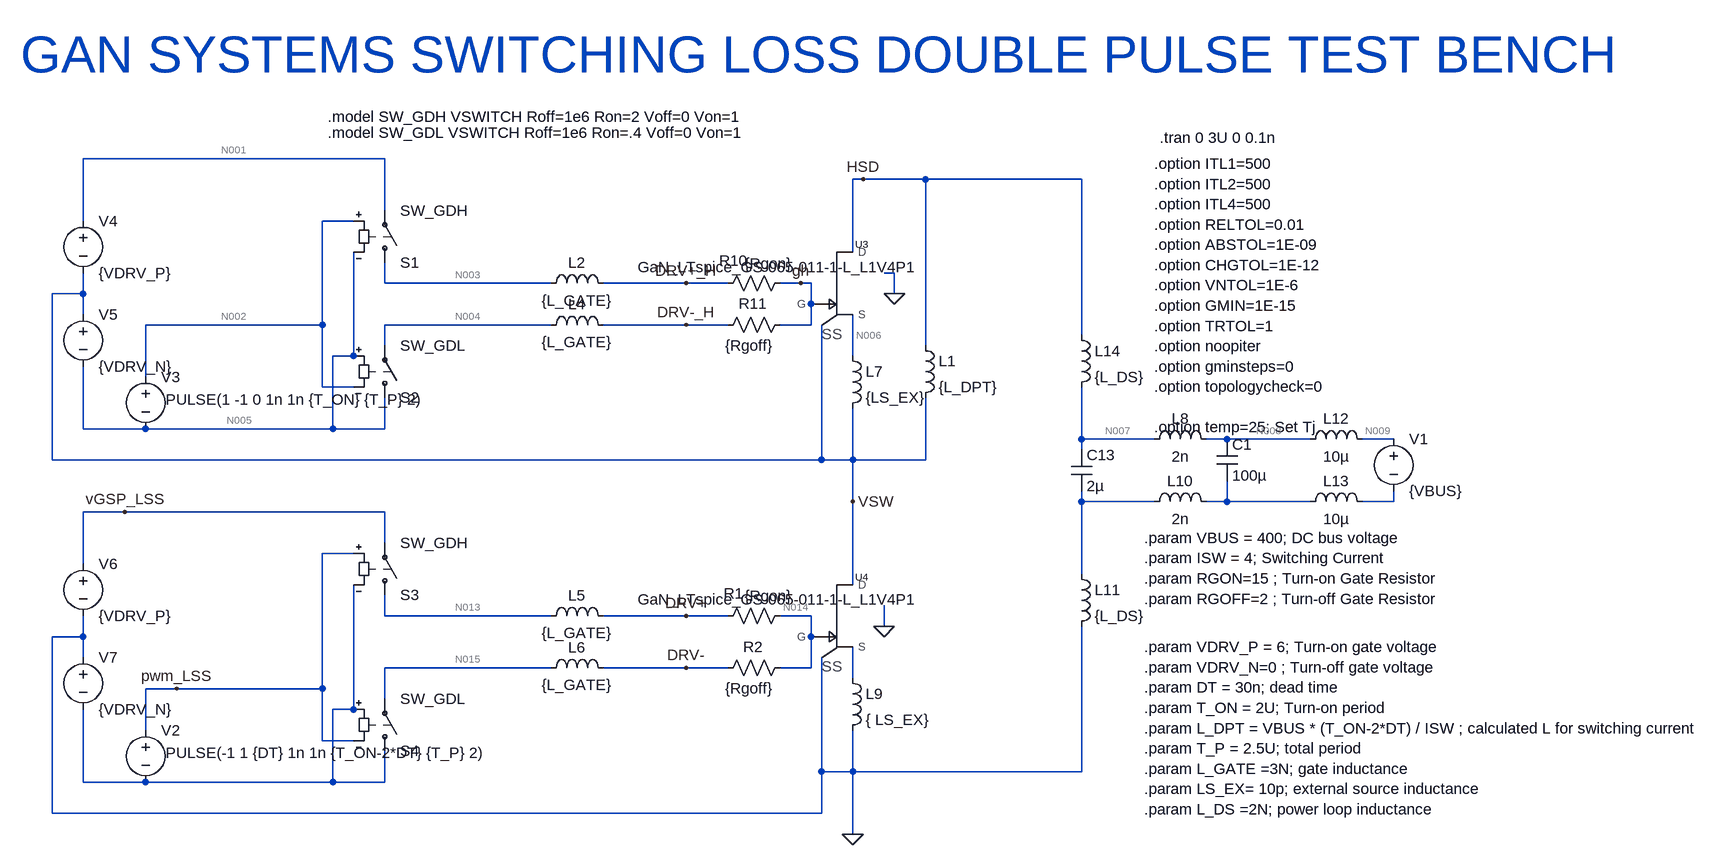
[diagram p0: schematic GN008_GANSYS_Half_Bridge_Switching_Test_v2.asc]
GN008_GANSYS_Half_Bridge_Switching_Test_v2.asc, the LTspice schematic file:
Version 4
SHEET 1 3212 1348
WIRE -576 -592 -1040 -592
WIRE 160 -560 144 -560
WIRE 256 -560 160 -560
WIRE 496 -560 256 -560
WIRE -576 -512 -576 -592
WIRE -1040 -496 -1040 -592
WIRE -624 -496 -672 -496
WIRE 144 -448 144 -560
WIRE 208 -416 192 -416
WIRE -576 -400 -576 -432
WIRE -320 -400 -576 -400
WIRE -112 -400 -240 -400
WIRE -48 -400 -112 -400
WIRE 64 -400 32 -400
WIRE 80 -400 64 -400
WIRE -1040 -384 -1040 -416
WIRE -1040 -384 -1088 -384
WIRE 208 -384 208 -416
WIRE 80 -368 80 -400
WIRE -1040 -352 -1040 -384
WIRE -672 -336 -672 -496
WIRE -672 -336 -944 -336
WIRE -320 -336 -576 -336
WIRE -112 -336 -240 -336
WIRE -48 -336 -112 -336
WIRE 80 -336 80 -368
WIRE 80 -336 32 -336
WIRE 496 -320 496 -560
WIRE -576 -304 -576 -336
WIRE 256 -304 256 -560
WIRE -624 -288 -624 -448
WIRE -624 -288 -656 -288
WIRE 144 -288 144 -352
WIRE -944 -256 -944 -336
WIRE -672 -240 -672 -336
WIRE -624 -240 -672 -240
WIRE -1040 -176 -1040 -272
WIRE -944 -176 -1040 -176
WIRE -656 -176 -656 -288
WIRE -656 -176 -944 -176
WIRE -576 -176 -576 -224
WIRE -576 -176 -656 -176
WIRE 496 -160 496 -240
WIRE 608 -160 496 -160
WIRE 720 -160 688 -160
WIRE 848 -160 720 -160
WIRE 976 -160 928 -160
WIRE 496 -144 496 -160
WIRE -1088 -128 -1088 -384
WIRE 96 -128 96 -336
WIRE 96 -128 -1088 -128
WIRE 144 -128 144 -208
WIRE 144 -128 96 -128
WIRE 256 -128 256 -224
WIRE 256 -128 144 -128
WIRE 144 -64 144 -128
WIRE 496 -64 496 -80
WIRE 608 -64 496 -64
WIRE 720 -64 720 -96
WIRE 720 -64 688 -64
WIRE 848 -64 720 -64
WIRE 976 -64 976 -80
WIRE 976 -64 928 -64
WIRE -976 -48 -1040 -48
WIRE -576 -48 -976 -48
WIRE -576 0 -576 -48
WIRE -624 16 -672 16
WIRE -1040 32 -1040 -48
WIRE 496 48 496 -64
WIRE 144 64 144 -64
WIRE -576 112 -576 80
WIRE -320 112 -576 112
WIRE -112 112 -240 112
WIRE -48 112 -112 112
WIRE 80 112 32 112
WIRE 192 128 192 96
WIRE -1040 144 -1040 112
WIRE -1040 144 -1088 144
WIRE 80 144 80 112
WIRE -1040 176 -1040 144
WIRE -320 192 -576 192
WIRE -112 192 -240 192
WIRE -48 192 -112 192
WIRE 80 192 80 144
WIRE 80 192 32 192
WIRE 144 208 144 160
WIRE -896 224 -944 224
WIRE -672 224 -672 16
WIRE -672 224 -896 224
WIRE -576 240 -576 192
WIRE -624 256 -624 64
WIRE -624 256 -656 256
WIRE -944 288 -944 224
WIRE -672 304 -672 224
WIRE -624 304 -672 304
WIRE 96 352 96 176
WIRE 144 352 144 288
WIRE 144 352 96 352
WIRE 496 352 496 128
WIRE 496 352 144 352
WIRE -1040 368 -1040 256
WIRE -944 368 -1040 368
WIRE -656 368 -656 256
WIRE -656 368 -944 368
WIRE -576 368 -576 320
WIRE -576 368 -656 368
WIRE -1088 416 -1088 144
WIRE 96 416 96 352
WIRE 96 416 -1088 416
WIRE 144 448 144 352
FLAG -976 -48 vGSP_LSS
FLAG -896 224 pwm_LSS
FLAG 144 448 0
FLAG -112 112 DRV+
FLAG -112 192 DRV-
FLAG 208 -384 0
FLAG 192 128 0
FLAG -112 -400 DRV+_H
FLAG -112 -336 DRV-_H
FLAG 64 -400 gh
FLAG 160 -560 HSD
FLAG 144 -64 VSW
SYMBOL voltage 976 -176 R0
WINDOW 123 0 0 Left 2
WINDOW 39 0 0 Left 2
SYMATTR InstName V1
SYMATTR Value {VBUS}
SYMBOL cap 480 -144 R0
SYMATTR InstName C13
SYMATTR Value 2µ
SYMBOL ind 832 -144 R270
WINDOW 0 32 56 VTop 2
WINDOW 3 5 56 VBottom 2
SYMATTR InstName L12
SYMATTR Value 10µ
SYMBOL ind 832 -48 R270
WINDOW 0 32 56 VTop 2
WINDOW 3 5 56 VBottom 2
SYMATTR InstName L13
SYMATTR Value 10µ
SYMBOL ind 480 -336 R0
SYMATTR InstName L14
SYMATTR Value {L_DS}
SYMATTR SpiceLine Rser=20m
SYMBOL ind 480 32 R0
SYMATTR InstName L11
SYMATTR Value {L_DS}
SYMATTR SpiceLine Rser=20m
SYMBOL sw -576 96 M180
SYMATTR InstName S3
SYMATTR Value SW_GDH
SYMBOL sw -576 336 M180
SYMATTR InstName S4
SYMATTR Value SW_GDL
SYMBOL cap 704 -160 R0
SYMATTR InstName C1
SYMATTR Value 100µ
SYMBOL ind 592 -144 R270
WINDOW 0 32 56 VTop 2
WINDOW 3 5 56 VBottom 2
SYMATTR InstName L8
SYMATTR Value 2n
SYMBOL ind 592 -48 R270
WINDOW 0 32 56 VTop 2
WINDOW 3 5 56 VBottom 2
SYMATTR InstName L10
SYMATTR Value 2n
SYMBOL voltage -944 272 R0
WINDOW 123 0 0 Left 2
WINDOW 39 0 0 Left 2
WINDOW 3 31 51 Left 2
SYMATTR Value PULSE(-1 1 {DT} 1n 1n {T_ON-2*DT} {T_P} 2)
SYMATTR InstName V2
SYMBOL res 48 96 R90
WINDOW 0 -3 87 VBottom 2
WINDOW 3 -30 33 VTop 2
SYMATTR InstName R1
SYMATTR Value {Rgon}
SYMBOL res 48 176 R90
WINDOW 0 -1 57 VBottom 2
WINDOW 3 32 63 VTop 2
SYMATTR InstName R2
SYMATTR Value {Rgoff}
SYMBOL sw -576 -416 M180
SYMATTR InstName S1
SYMATTR Value SW_GDH
SYMBOL sw -576 -208 M180
SYMATTR InstName S2
SYMATTR Value SW_GDL
SYMBOL voltage -944 -272 R0
WINDOW 123 0 0 Left 2
WINDOW 39 0 0 Left 2
WINDOW 3 31 51 Left 2
SYMATTR Value PULSE(1 -1 0 1n 1n {T_ON} {T_P} 2)
SYMATTR InstName V3
SYMBOL res 48 -416 R90
WINDOW 0 -3 87 VBottom 2
WINDOW 3 -30 33 VTop 2
SYMATTR InstName R10
SYMATTR Value {Rgon}
SYMBOL res 48 -352 R90
WINDOW 0 -1 57 VBottom 2
WINDOW 3 32 63 VTop 2
SYMATTR InstName R11
SYMATTR Value {Rgoff}
SYMBOL ind 240 -320 R0
SYMATTR InstName L1
SYMATTR Value {L_DPT}
SYMATTR SpiceLine Rser=10m
SYMBOL voltage -1040 -512 R0
WINDOW 123 0 0 Left 2
WINDOW 39 0 0 Left 2
SYMATTR InstName V4
SYMATTR Value {VDRV_P}
SYMBOL voltage -1040 -368 R0
WINDOW 123 0 0 Left 2
WINDOW 39 0 0 Left 2
SYMATTR InstName V5
SYMATTR Value {VDRV_N}
SYMBOL voltage -1040 16 R0
WINDOW 123 0 0 Left 2
WINDOW 39 0 0 Left 2
SYMATTR InstName V6
SYMATTR Value {VDRV_P}
SYMBOL voltage -1040 160 R0
WINDOW 123 0 0 Left 2
WINDOW 39 0 0 Left 2
SYMATTR InstName V7
SYMATTR Value {VDRV_N}
SYMBOL ind -336 -384 R270
WINDOW 0 32 56 VTop 2
WINDOW 3 5 56 VBottom 2
SYMATTR InstName L2
SYMATTR Value {L_GATE}
SYMBOL ind -336 -320 R270
WINDOW 0 32 56 VTop 2
WINDOW 3 5 56 VBottom 2
SYMATTR InstName L4
SYMATTR Value {L_GATE}
SYMBOL ind -336 128 R270
WINDOW 0 32 56 VTop 2
WINDOW 3 5 56 VBottom 2
SYMATTR InstName L5
SYMATTR Value {L_GATE}
SYMBOL ind -336 208 R270
WINDOW 0 32 56 VTop 2
WINDOW 3 5 56 VBottom 2
SYMATTR InstName L6
SYMATTR Value {L_GATE}
SYMBOL ind 128 -304 R0
SYMATTR InstName L7
SYMATTR Value {LS_EX}
SYMBOL ind 128 192 R0
SYMATTR InstName L9
SYMATTR Value { LS_EX}
SYMBOL GaNSystems\\GaN_LTspice_GS-065-011-1-L_L1V4P1 96 -400 R0
SYMATTR InstName U3
SYMBOL GaNSystems\\GaN_LTspice_GS-065-011-1-L_L1V4P1 96 112 R0
SYMATTR InstName U4
TEXT 616 -624 Left 2 !.tran 0 3U 0 0.1n
TEXT 592 160 Left 2 !.param VDRV_P = 6; Turn-on gate voltage\n.param VDRV_N=0 ; Turn-off gate voltage\n.param DT = 30n; dead time\n.param T_ON = 2U; Turn-on period\n.param L_DPT = VBUS * (T_ON-2*DT) / ISW ; calculated L for switching current\n.param T_P = 2.5U; total period\n.param L_GATE =3N; gate inductance\n.param LS_EX= 10p; external source inductance\n.param L_DS =2N; power loop inductance
TEXT 608 -584 Left 2 !.option ITL1=500\n.option ITL2=500\n.option ITL4=500\n.option RELTOL=0.01\n.option ABSTOL=1E-09\n.option CHGTOL=1E-12\n.option VNTOL=1E-6\n.option GMIN=1E-15\n.option TRTOL=1\n.option noopiter\n.option gminsteps=0\n.option topologycheck=0\n \n.option temp=25; Set Tj
TEXT -664 -656 Left 2 !.model SW_GDH VSWITCH Roff=1e6 Ron=2 Voff=0 Von=1
TEXT -664 -632 Left 2 !.model SW_GDL VSWITCH Roff=1e6 Ron=.4 Voff=0 Von=1
TEXT -1136 -752 Left 6 ;GAN SYSTEMS SWITCHING LOSS DOUBLE PULSE TEST BENCH
TEXT 592 -8 Left 2 !.param VBUS = 400; DC bus voltage\n.param ISW = 4; Switching Current\n.param RGON=15 ; Turn-on Gate Resistor\n.param RGOFF=2 ; Turn-off Gate Resistor

The netlist it stands for:
* GN008_GANSYS_Half_Bridge_Switching_Test_v2.asc
V1 N009 N012 {VBUS}
C13 N007 N010 2µ
L12 N008 N009 10µ
L13 N011 N012 10µ
L14 HSD N007 {L_DS} Rser=20m
L11 N010 0 {L_DS} Rser=20m
S3 N013 vGSP_LSS pwm_LSS N017 SW_GDH
S4 N017 N015 N017 pwm_LSS SW_GDL
C1 N008 N011 100µ
L8 N007 N008 2n
L10 N010 N011 2n
V2 pwm_LSS N017 PULSE(-1 1 {DT} 1n 1n {T_ON-2*DT} {T_P} 2)
R1 N014 DRV+ {Rgon}
R2 N014 DRV- {Rgoff}
S1 N003 N001 N002 N005 SW_GDH
S2 N005 N004 N005 N002 SW_GDL
V3 N002 N005 PULSE(1 -1 0 1n 1n {T_ON} {T_P} 2)
R10 gh DRV+_H {Rgon}
R11 gh DRV-_H {Rgoff}
L1 HSD VSW {L_DPT} Rser=10m
V4 N001 VSW {VDRV_P}
V5 VSW N005 {VDRV_N}
V6 vGSP_LSS 0 {VDRV_P}
V7 0 N017 {VDRV_N}
L2 N003 DRV+_H {L_GATE}
L4 N004 DRV-_H {L_GATE}
L5 N013 DRV+ {L_GATE}
L6 N015 DRV- {L_GATE}
L7 N006 VSW {LS_EX}
L9 N016 0 { LS_EX}
XU3 gh HSD N006 VSW GaN_LTspice_GS-065-011-1-L_L1V4P1  ; pins G D S SS
XU4 N014 VSW N016 0 GaN_LTspice_GS-065-011-1-L_L1V4P1  ; pins G D S SS
.tran 0 3U 0 0.1n
.param VDRV_P = 6; Turn-on gate voltage
.param VDRV_N=0 ; Turn-off gate voltage
.param DT = 30n; dead time
.param T_ON = 2U; Turn-on period
.param L_DPT = VBUS * (T_ON-2*DT) / ISW ; calculated L for switching current
.param T_P = 2.5U; total period
.param L_GATE =3N; gate inductance
.param LS_EX= 10p; external source inductance
.param L_DS =2N; power loop inductance
.option ITL1=500
.option ITL2=500
.option ITL4=500
.option RELTOL=0.01
.option ABSTOL=1E-09
.option CHGTOL=1E-12
.option VNTOL=1E-6
.option GMIN=1E-15
.option TRTOL=1
.option noopiter
.option gminsteps=0
.option topologycheck=0
.option temp=25; Set Tj
.model SW_GDH VSWITCH Roff=1e6 Ron=2 Voff=0 Von=1
.model SW_GDL VSWITCH Roff=1e6 Ron=.4 Voff=0 Von=1
* GAN SYSTEMS SWITCHING LOSS DOUBLE PULSE TEST BENCH
.param VBUS = 400; DC bus voltage
.param ISW = 4; Switching Current
.param RGON=15 ; Turn-on Gate Resistor
.param RGOFF=2 ; Turn-off Gate Resistor
.lib GaN_LTspice_GS-065-011-1-L_L1V4P1.lib
.backanno
.end

* Results of the author's LTspice run, read from the files saved beside the schematic
* Operating Point, zero values left out:
*   V(n009) = 400 V
*   V(n007) = 400 V
*   V(n008) = 400 V
*   V(hsd) = 400 V
*   V(n013) = 104.7 µV
*   V(vgsp_lss) = 6 V
*   V(pwm_lss) = -1 V
*   V(n015) = 2.44 µV
*   V(n014) = 14.65 µV
*   V(drv+) = 104.6 µV
*   V(drv-) = 2.446 µV
*   V(n003) = 406 V
*   V(n001) = 406 V
*   V(n002) = 401 V
*   V(n005) = 400 V
*   V(n004) = 406 V
*   V(gh) = 406 V
*   V(drv+_h) = 406 V
*   V(drv-_h) = 406 V
*   V(vsw) = 400 V
*   V(n006) = 400 V
*   I(L9) = 80.65 nA
*   I(L7) = 13.53 nA
*   I(L6) = -6.1 µA
*   I(L5) = 6 µA
*   I(L4) = -6 µA
*   I(L2) = 6.003 µA
*   I(L1) = 185.5 nA
*   I(L10) = 197.9 nA
*   I(L8) = -197.6 nA
*   I(L11) = -197.9 nA
*   I(L14) = -197.6 nA
*   I(L13) = 197.9 nA
*   I(L12) = -197.9 nA
*   I(R11) = 6 µA
*   I(R10) = -6.003 µA
*   I(R2) = 6.1 µA
*   I(R1) = -6 µA
*   I(S2) = 6 µA
*   I(S4) = 6.1 µA
*   I(S1) = 6.003 µA
*   I(S3) = 6 µA
*   I(V7) = -6.1 µA
*   I(V6) = -6 µA
*   I(V5) = -6 µA
*   I(V4) = -6.003 µA
*   I(V1) = -197.9 nA
*   Ix(u3:GATEIN) = 3 nA
*   Ix(u3:DRAININ) = 12.11 nA
*   Ix(u3:SOURCEIN) = -13.49 nA
*   Ix(u3:SOURCE_S) = -3.238 nA
*   Ix(u4:GATEIN) = -100 nA
*   Ix(u4:DRAININ) = 199.4 nA
*   Ix(u4:SOURCEIN) = -80.65 nA
*   Ix(u4:SOURCE_S) = -19.35 nA